# Altium schematic sheet conn_board_adc.SchDoc
size A
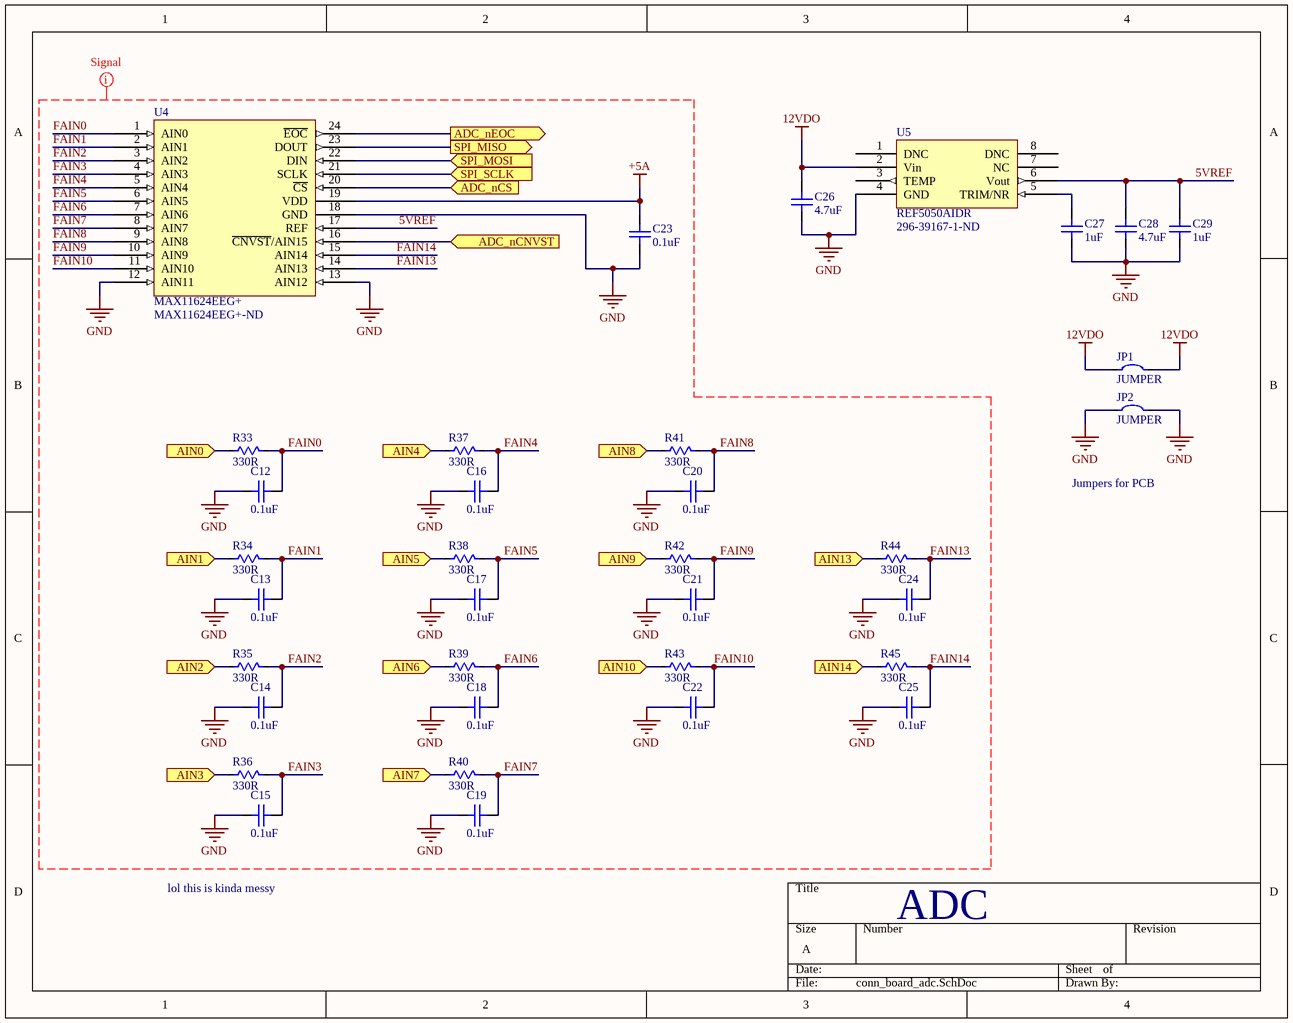
[diagram p0: conn_board_adc.SchDoc]

## Parts
C12  0.1uF  [CAP_0805]
C13  0.1uF  [CAP_0805]
C14  0.1uF  [CAP_0805]
C15  0.1uF  [CAP_0805]
C16  0.1uF  [CAP_0805]
C17  0.1uF  [CAP_0805]
C18  0.1uF  [CAP_0805]
C19  0.1uF  [CAP_0805]
C20  0.1uF  [CAP_0805]
C21  0.1uF  [CAP_0805]
C22  0.1uF  [CAP_0805]
C23  0.1uF  [CAP_0805]
C24  0.1uF  [CAP_0805]
C25  0.1uF  [CAP_0805]
C26  4.7uF  [CAP_0805]
C27  1uF  [CAP_0805]
C28  4.7uF  [CAP_0805]
C29  1uF  [CAP_0805]
JP1  JUMPER  [JMP_20MM]
JP2  JUMPER  [JMP_20MM]
R33  330R  [RES_0805_PANASONIC]
R34  330R  [RES_0805_PANASONIC]
R35  330R  [RES_0805_PANASONIC]
R36  330R  [RES_0805_PANASONIC]
R37  330R  [RES_0805_PANASONIC]
R38  330R  [RES_0805_PANASONIC]
R39  330R  [RES_0805_PANASONIC]
R40  330R  [RES_0805_PANASONIC]
R41  330R  [RES_0805_PANASONIC]
R42  330R  [RES_0805_PANASONIC]
R43  330R  [RES_0805_PANASONIC]
R44  330R  [RES_0805_PANASONIC]
R45  330R  [RES_0805_PANASONIC]
U4  MAX11624EEG+  Supplier Part Number 1: MAX11624EEG+-ND  [QSOP24]
U5  REF5050AIDR  Supplier Part Number 1: 296-39167-1-ND  [SOIC_8]

## Ports
ADC_nCNVST (in), ADC_nCS (in), ADC_nEOC (out), AIN0 (in), AIN1 (in), AIN2 (in), AIN3 (in), AIN4 (in), AIN5 (in), AIN6 (in), AIN7 (in), AIN8 (in), AIN9 (in), AIN10 (in), AIN13 (in), AIN14 (in), SPI_MISO (out), SPI_MOSI (in), SPI_SCLK (in)

## Nets
12VDO: C26.2 JP1.1 JP1.2 U5.2(Vin)
+5A: C23.1 U4.19(VDD)
GND: C12.1 C13.1 C14.1 C15.1 C16.1 C17.1 C18.1 C19.1 C20.1 C21.1 C22.1 C23.2 C24.1 C25.1 C26.1 C27.1 C28.1 C29.1 JP2.1 JP2.2 U4.12(AIN11) U4.13(AIN12) U4.18(GND) U5.4(GND)
5VREF: C28.2 C29.2 U4.17(REF) U5.6(Vout)
ADC_nCNVST: U4.16(~{CNVST}/AIN15) ; port ADC_nCNVST
ADC_nCS: U4.20(~{CS}) ; port ADC_nCS
ADC_nEOC: U4.24(~{EOC}) ; port ADC_nEOC
AIN0: R33.1 ; port AIN0
AIN1: R34.1 ; port AIN1
AIN2: R35.1 ; port AIN2
AIN3: R36.1 ; port AIN3
AIN4: R37.1 ; port AIN4
AIN5: R38.1 ; port AIN5
AIN6: R39.1 ; port AIN6
AIN7: R40.1 ; port AIN7
AIN8: R41.1 ; port AIN8
AIN9: R42.1 ; port AIN9
AIN10: R43.1 ; port AIN10
AIN13: R44.1 ; port AIN13
AIN14: R45.1 ; port AIN14
FAIN0: C12.2 R33.2 U4.1(AIN0)
FAIN1: C13.2 R34.2 U4.2(AIN1)
FAIN2: C14.2 R35.2 U4.3(AIN2)
FAIN3: C15.2 R36.2 U4.4(AIN3)
FAIN4: C16.2 R37.2 U4.5(AIN4)
FAIN5: C17.2 R38.2 U4.6(AIN5)
FAIN6: C18.2 R39.2 U4.7(AIN6)
FAIN7: C19.2 R40.2 U4.8(AIN7)
FAIN8: C20.2 R41.2 U4.9(AIN8)
FAIN9: C21.2 R42.2 U4.10(AIN9)
FAIN10: C22.2 R43.2 U4.11(AIN10)
FAIN13: C24.2 R44.2 U4.14(AIN13)
FAIN14: C25.2 R45.2 U4.15(AIN14)
SPI_MISO: U4.23(DOUT) ; port SPI_MISO
SPI_MOSI: U4.22(DIN) ; port SPI_MOSI
SPI_SCLK: U4.21(SCLK) ; port SPI_SCLK
NetC27_2: C27.2 U5.5(TRIM/NR)

Not connected (* = marked no-connect by the designer): U5 1(DNC) 3(TEMP) 7(NC) 8(DNC)

## Layout directives
net class Signal: 5VREF, +5A, FAIN0, FAIN1, FAIN2, FAIN3, FAIN4, FAIN5, FAIN6, FAIN7, FAIN8, FAIN9, FAIN10, FAIN13, FAIN14, GND

## Notes on the sheet
- Jumpers for PCB
- lol this is kinda messy
- ADC

## Library data of the parts
C12-C25 = C0805C104M3RACTU: CAP CER 0.1UF 25V X7R 0805; Manufacturer: KEMET; Dielectric Material: Ceramic; Capacitance: 100nF; Tolerance: 20%; Dissipation Factor: 5%; Supplier 1: Digi-Key; Manufacturer Part Number: C0805C104M3RACTU; RoHS: Yes; Category: Capacitor; Stock 1: 305175; Pricing 1: 1=0.10000, 10=0.06800, 50=0.03700, 100=0.03020, 500=0.02160, 1000=0.01697 (USD); Mount: Surface Mount; Case/Package: 0805; Case Code (Metric): 2012; Case Code (Imperial): 0805; Min Operating Temperature: -55°C; Max Operating Temperature: 125°C; Packaging: Tape and Reel; Package Quantity: 1; Voltage Rating (DC): 25V; Dielectric: X7R; Voltage Rating: 25V; Termination: SMD/SMT; Voltage: 25V; Length: 2mm; Height: 0.9mm; Width: 0.049inch; Thickness: 0.035inch; Depth: 1.25mm; Lead Pitch: 0.75mm; Radiation Hardening: No; REACH SVHC: No SVHC; ComponentLink1URL: http://www.mouser.com/ds/2/212/KEM_C1002_X7R_SMD-1102033.pdf?src-supplier=Mouser; ComponentLink1Description: http://www.mouser.com/ds/2/212/KEM_C1002_X7R_SMD-1102033.pdf?src-supplier=Mouser; ComponentLink2URL: http://uk.rs-online.com/webdocs/13da/0900766b813da9ff.pdf?src-supplier=RSComponents; ComponentLink2Description: http://uk.rs-online.com/webdocs/13da/0900766b813da9ff.pdf?src-supplier=RSComponents; ComponentLink3URL: http://components.arrow.com/part/dataview/0323_00178100?src-supplier=Arrow+Europe; ComponentLink3Description: http://components.arrow.com/part/dataview/0323_00178100?src-supplier=Arrow+Europe; ComponentLink4URL: https://www.alliedelec.com/m/d/6f3b5eb83d09db50ed28bdc730567b33.pdf?src-supplier=Allied+Electronics; ComponentLink4Description: https://www.alliedelec.com/m/d/6f3b5eb83d09db50ed28bdc730567b33.pdf?src-supplier=Allied+Electronics; ComponentLink5URL: http://www.farnell.com/datasheets/2746330.pdf?src-supplier=Farnell; ComponentLink5Description: http://www.farnell.com/datasheets/2746330.pdf?src-supplier=Farnell; Supplier Part Number 1: 399-8000-1-ND; ComponentLink6URL: http://www.jameco.com/Jameco/Products/ProdDS/1566487.pdf?src-supplier=Jameco; ComponentLink6Description: http://www.jameco.com/Jameco/Products/ProdDS/1566487.pdf?src-supplier=Jameco; ComponentLink7URL: http://components.arrow.com/part/dataview/2091097S3491315N7429?src-supplier=Arrow+Electronics; ComponentLink7Description: http://components.arrow.com/part/dataview/2091097S3491315N7429?src-supplier=Arrow+Electronics; ComponentLink8URL: https://www.alliedelec.com/m/d/e7aa2b5497e2375e4ffc0e8be19e16e2.pdf?src-supplier=Allied+Electronics; ComponentLink8Description: https://www.alliedelec.com/m/d/e7aa2b5497e2375e4ffc0e8be19e16e2.pdf?src-supplier=Allied+Electronics; ComponentLink9URL: http://uk.rs-online.com/webdocs/13da/0900766b813daa05.pdf?src-supplier=RSComponents; ComponentLink9Description: http://uk.rs-online.com/webdocs/13da/0900766b813daa05.pdf?src-supplier=RSComponents; ComponentLink10URL: http://www.farnell.com/datasheets/2746330.pdf?src-supplier=Element14; ComponentLink10Description: http://www.farnell.com/datasheets/2746330.pdf?src-supplier=Element14; ComponentLink11URL: https://api.kemet.com/component-edge/download/datasheet/C0805C104M3RACTU.pdf?src-supplier=Digi-Key; ComponentLink11Description: https://api.kemet.com/component-edge/download/datasheet/C0805C104M3RACTU.pdf?src-supplier=Digi-Key; ComponentLink12URL: http://www.farnell.com/datasheets/1828800.pdf?src-supplier=Newark; ComponentLink12Description: http://www.farnell.com/datasheets/1828800.pdf?src-supplier=Newark; ComponentLink13URL: http://www.farnell.com/datasheets/2746330.pdf?src-supplier=Newark; ComponentLink13Description: http://www.farnell.com/datasheets/2746330.pdf?src-supplier=Newark; ComponentLink14URL: http://capacitoredge.kemet.com/capedge2/DataSheet?pn=C0805C104M3RACTU&src-supplier=Avnet; ComponentLink14Description: http://capacitoredge.kemet.com/capedge2/DataSheet?pn=C0805C104M3RACTU&src-supplier=Avnet
C26 C28 = CL21A475KAQNNNE: SAMSUNG ELECTRO-MECHANICS - CL21A475KAQNNNE - SMD Multilayer Ceramic Capacitor, 4.7 µF, 25 V, 0805 [2012 Metric], ± 10%, X5R, CL Series; Voltage Rating (DC): 25V; Supplier 1: Digi-Key; Manufacturer: Samsung; Manufacturer Part Number: CL21A475KAQNNNE; RoHS: Yes; Category: Ceramic Capacitors; Stock 1: 671990; Pricing 1: 1=0.11000, 10=0.08100, 50=0.04600, 100=0.03820, 500=0.02678, 1000=0.02216 (USD); Mount: Surface Mount; Case/Package: 0805; Case Code (Metric): 2012; Case Code (Imperial): 0805; Min Operating Temperature: -55°C; Max Operating Temperature: 85°C; Dielectric: X5R; Package Quantity: 1; Packaging: Tape and Reel; Capacitance: 4.7uF; Tolerance: 10%; Voltage Rating: 25V; Length: 2mm; Width: 0.049inch; Height: 1.25mm; Thickness: 0.055inch; Depth: 1.25mm; Radiation Hardening: No; Lead Free: Lead Free; ComponentLink1URL: https://datasheet.ciiva.com/25798/cl21a475kaqnnne-25798882.pdf?src-supplier=Digi-Key; ComponentLink1Description: https://datasheet.ciiva.com/25798/cl21a475kaqnnne-25798882.pdf?src-supplier=Digi-Key; Supplier Part Number 1: 1276-1244-1-ND
C27 C29 = C0805C105Z4VACTU: Cap Ceramic 1uF 16V Y5V -20% to 80% Pad SMD 0805 85C T/R; Manufacturer: KEMET; Dissipation Factor: 7%; Supplier 1: Digi-Key; Manufacturer Part Number: C0805C105Z4VACTU; Category: Capacitor; Stock 1: 83211; Pricing 1: 1=0.11000, 10=0.08100, 50=0.04420, 100=0.03620, 500=0.02584, 1000=0.02030 (USD); Mount: Surface Mount; Case/Package: 0805; Number of Pins: 2; Case Code (Metric): 2012; Case Code (Imperial): 0805; Contact Material: Tin; Dielectric Material: Ceramic; Min Operating Temperature: -30°C; Max Operating Temperature: 85°C; Package Quantity: 1; Capacitance: 1uF; Voltage Rating: 16V; Tolerance: 80%; Packaging: Tape and Reel; Voltage Rating (DC): 16V; Dielectric: Y5V; Termination: SMD/SMT; Voltage: 16V; Length: 2mm; Height: 1.25mm; Width: 0.049inch; Thickness: 0.055inch; Lead Pitch: 0.75mm; Depth: 1.25mm; Radiation Hardening: No; REACH SVHC: No SVHC; Lead Free: Lead Free; ComponentLink1URL: https://datasheet.ciiva.com/6074/1698780-6074369.pdf?src-supplier=Farnell; ComponentLink1Description: https://datasheet.ciiva.com/6074/1698780-6074369.pdf?src-supplier=Farnell; ComponentLink2URL: https://datasheet.ciiva.com/16623/datasheetpn-c0805c105z4vac7800-16623623.pdf?src-supplier=Avnet+Europe; ComponentLink2Description: https://datasheet.ciiva.com/16623/datasheetpn-c0805c105z4vac7800-16623623.pdf?src-supplier=Avnet+Europe; ComponentLink3URL: https://datasheet.ciiva.com/14604/70095383-14604106.pdf?src-supplier=Allied+Electronics; ComponentLink3Description: https://datasheet.ciiva.com/14604/70095383-14604106.pdf?src-supplier=Allied+Electronics; ComponentLink4URL: https://datasheet.ciiva.com/7600/1698780-7600029.pdf?src-supplier=Newark; ComponentLink4Description: https://datasheet.ciiva.com/7600/1698780-7600029.pdf?src-supplier=Newark; ComponentLink5URL: https://datasheet.ciiva.com/14589/70095383-14589407.pdf?src-supplier=Allied+Electronics; ComponentLink5Description: https://datasheet.ciiva.com/14589/70095383-14589407.pdf?src-supplier=Allied+Electronics; ComponentLink6URL: http://datasheet.octopart.com/C0805C105Z4VACTU-Kemet-datasheet-13692877.pdf?src-supplier=Element14; ComponentLink6Description: http://datasheet.octopart.com/C0805C105Z4VACTU-Kemet-datasheet-13692877.pdf?src-supplier=Element14; ComponentLink7URL: http://datasheet.octopart.com/C0805C105Z4VACTU-Kemet-datasheet-503297.pdf?src-supplier=Newark; ComponentLink7Description: http://datasheet.octopart.com/C0805C105Z4VACTU-Kemet-datasheet-503297.pdf?src-supplier=Newark; ComponentLink8URL: http://datasheet.octopart.com/C0805C105Z4VACTU-KEMET-datasheet-101576167.pdf?src-supplier=Farnell; ComponentLink8Description: http://datasheet.octopart.com/C0805C105Z4VACTU-KEMET-datasheet-101576167.pdf?src-supplier=Farnell; ComponentLink9URL: http://datasheet.octopart.com/C0805C105Z4VACTU-KEMET-datasheet-83957834.pdf?src-supplier=TME; ComponentLink9Description: http://datasheet.octopart.com/C0805C105Z4VACTU-KEMET-datasheet-83957834.pdf?src-supplier=TME; ComponentLink10URL: http://datasheet.octopart.com/C0805C105Z4VACTU-Kemet-datasheet-5313890.pdf?src-supplier=Verical; ComponentLink10Description: http://datasheet.octopart.com/C0805C105Z4VACTU-Kemet-datasheet-5313890.pdf?src-supplier=Verical; ComponentLink11URL: http://datasheet.octopart.com/C0805C105Z4VAC-TU-Kemet-datasheet-8204015.pdf?src-supplier=Jameco; ComponentLink11Description: http://datasheet.octopart.com/C0805C105Z4VAC-TU-Kemet-datasheet-8204015.pdf?src-supplier=Jameco; ComponentLink12URL: http://datasheet.octopart.com/C0805C105Z4VACTU-Kemet-datasheet-464.pdf?src-supplier=Allied+Electronics; ComponentLink12Description: http://datasheet.octopart.com/C0805C105Z4VACTU-Kemet-datasheet-464.pdf?src-supplier=Allied+Electronics; ComponentLink13URL: http://datasheet.octopart.com/C0805C105Z4VACTU-Kemet-datasheet-11554470.pdf?src-supplier=Arrow; ComponentLink13Description: http://datasheet.octopart.com/C0805C105Z4VACTU-Kemet-datasheet-11554470.pdf?src-supplier=Arrow; ComponentLink14URL: http://datasheet.octopart.com/C0805C105Z4VACTU-Kemet-datasheet-66128697.pdf?src-supplier=Element14; ComponentLink14Description: http://datasheet.octopart.com/C0805C105Z4VACTU-Kemet-datasheet-66128697.pdf?src-supplier=Element14; ComponentLink15URL: http://datasheet.octopart.com/C0805C105Z4VACTU-Kemet-datasheet-66325528.pdf?src-supplier=Newark; ComponentLink15Description: http://datasheet.octopart.com/C0805C105Z4VACTU-Kemet-datasheet-66325528.pdf?src-supplier=Newark; ComponentLink16URL: http://datasheet.octopart.com/C0805C105Z4VACTU-Kemet-datasheet-67847115.pdf?src-supplier=TME; ComponentLink16Description: http://datasheet.octopart.com/C0805C105Z4VACTU-Kemet-datasheet-67847115.pdf?src-supplier=TME; ComponentLink17URL: http://datasheet.octopart.com/C0805C105Z4VACTU-KEMET-datasheet-84169754.pdf; ComponentLink17Description: http://datasheet.octopart.com/C0805C105Z4VACTU-KEMET-datasheet-84169754.pdf; ComponentLink18URL: http://datasheet.octopart.com/C0805C105Z4VACTU-KEMET-datasheet-41193421.pdf?src-supplier=Master+Electronics; ComponentLink18Description: http://datasheet.octopart.com/C0805C105Z4VACTU-KEMET-datasheet-41193421.pdf?src-supplier=Master+Electronics; Supplier Part Number 1: 399-8011-1-ND
R33-R45 = ERA-6AED331V: Res Thin Film 0805 330 Ohm 0.5% 0.125W(1/8W) ±25ppm/C Molded SMD Automotive Punched T/R; Manufacturer: Panasonic; Temperature Coefficient: 25ppm/°C; Power Rating: 125mW; Voltage Rating: 200V; Supplier 1: Digi-Key; Manufacturer Part Number: ERA-6AED331V; RoHS: Yes; Category: Resistor; Stock 1: 11862; Pricing 1: 1=0.10000, 10=0.09400, 25=0.06480, 50=0.05040, 100=0.03600, 250=0.02808, 500=0.02232, 1000=0.01584 (USD); Case/Package: 0805; Case Code (Metric): 2012; Case Code (Imperial): 0805; Min Operating Temperature: -55°C; Max Operating Temperature: 155°C; Package Quantity: 5000; Packaging: Tape and Reel; Resistance: 330R; Tolerance: 0.5%; Length: 2mm; Height: 0.5mm; Width: 1.25mm; Lead Free: Lead Free; ComponentLink1URL: https://datasheet.ciiva.com/24071/aoa0000ce26-197354-24071480.pdf?src-supplier=Mouser; ComponentLink1Description: https://datasheet.ciiva.com/24071/aoa0000ce26-197354-24071480.pdf?src-supplier=Mouser; Supplier Part Number 1: P123837CT-ND; Mount: Surface Mount; Contact Plating: Tin; Termination: SMD/SMT; Resistor Type: Thin Film; Depth: 1.25mm; Military Standard: Not; ComponentLink2URL: https://datasheet.ciiva.com/9182/aoa0000ce26-9182970.pdf?src-supplier=Avnet; ComponentLink2Description: https://datasheet.ciiva.com/9182/aoa0000ce26-9182970.pdf?src-supplier=Avnet
U4 = MAX11624EEG+: GLOVE, POLYAMIDE, L/FREE, PU, SIZE 6 - More Details; Manufacturer: Maxim; Resolution: 10b; Sampling Rate: 300000S/s; Number of A/D Converters: 1; Number of Analog Inputs: 16; Polarity: Unipolar; Signal to Noise Ratio (SNR): 49dB; Number of Bits: 10; Supply Type: Single; Conversion Rate: 300KS/s; Interface: SPI,Serial; Max Power Dissipation: 762mW; Operating Supply Voltage: 5.25V; Supplier 1: Digi-Key; Manufacturer Part Number: MAX11624EEG+; RoHS: Yes; Category: IC; Stock 1: 35; Pricing 1: 1=6.76000, 10=6.11000, 25=5.82520, 100=4.83080, 250=4.82100 (USD); Mount: Surface Mount; Case/Package: QSOP; Number of Pins: 24; Min Operating Temperature: -40°C; Max Operating Temperature: 85°C; Number of Converters: 1; Packaging: Rail/Tube; Number of Channels: 16; Package Quantity: 50; Radiation Hardening: No; ComponentLink1URL: https://datasheet.ciiva.com/16611/max11618-max11625-16611389.pdf?src-supplier=Avnet+Europe; ComponentLink1Description: https://datasheet.ciiva.com/16611/max11618-max11625-16611389.pdf?src-supplier=Avnet+Europe; ComponentLink2URL: https://datasheet.ciiva.com/3039/max11618-max11625-3039027.pdf?src-supplier=Avnet; ComponentLink2Description: https://datasheet.ciiva.com/3039/max11618-max11625-3039027.pdf?src-supplier=Avnet
U5 = REF5050AIDR: TEXAS INSTRUMENTS - REF5050AIDR - VOLTAGE REF, SERIES, 5V, SOIC-8; Max Input Voltage: 18V; Max Output Current: 10mA; Min Input Voltage: 5.2V; Temperature Coefficient: 3ppm/°C; Quiescent Current: 1mA; Tolerance: 0.1%; Nominal Supply Current: 800uA; Number of Channels: 1; Operating Supply Current: 1.2mA; Output Type: Fixed; Supplier 1: Digi-Key; Manufacturer: Texas Instruments; Manufacturer Part Number: REF5050AIDR; RoHS: Yes; Category: Voltage References; Stock 1: 3640; Pricing 1: 1=2.92000, 10=2.61800, 25=2.47520, 100=2.03500, 250=1.82600, 500=1.76000, 1000=1.46300 (USD); Case/Package: D; Number of Pins: 8; Weight: 0.002677oz; Min Operating Temperature: -40°C; Max Operating Temperature: 125°C; Output Voltage: 5V; Packaging: Tape and Reel; Package Quantity: 2500; Output Current: 10mA; Reference Type: Series; Reference Voltage: 5V; Min Output Voltage: 5V; Radiation Hardening: No; Lead Free: Lead Free; REACH SVHC: No SVHC; ComponentLink1URL: https://datasheet.ciiva.com/4065/43001021s8324725n7713-4065643.pdf?src-supplier=Arrow+Electronics; ComponentLink1Description: https://datasheet.ciiva.com/4065/43001021s8324725n7713-4065643.pdf?src-supplier=Arrow+Electronics; ComponentLink2URL: https://datasheet.ciiva.com/3236/ref5050-3236312.pdf?src-supplier=Avnet; ComponentLink2Description: https://datasheet.ciiva.com/3236/ref5050-3236312.pdf?src-supplier=Avnet; ComponentLink3URL: https://datasheet.ciiva.com/2012/ref5020-2012761.pdf?src-supplier=Digi-Key; ComponentLink3Description: https://datasheet.ciiva.com/2012/ref5020-2012761.pdf?src-supplier=Digi-Key